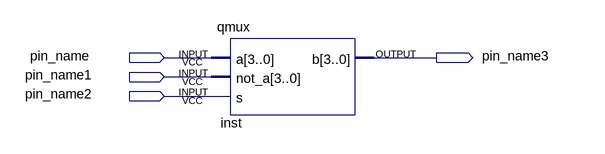
[diagram p0: schematic sheet]
// Quartus schematic mux.bdf as structural Verilog: 1 symbols, 4 pins
module mux (
  input  pin_name,
  input  pin_name1,
  input  pin_name2,
  output pin_name3
);

  qmux inst (.b(pin_name3));  // open: a, not_a, s
endmodule
